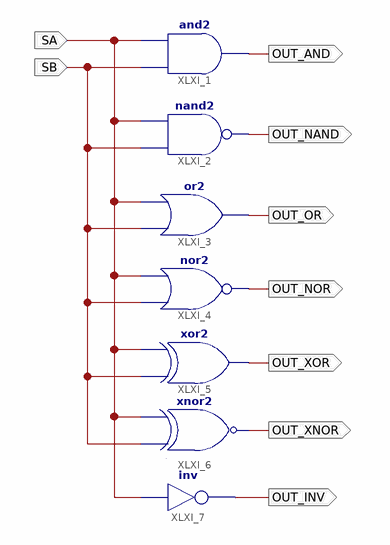
[diagram p0: schematic sheet 1]
// Xilinx ISE schematic GATES.sch (spartan6) as structural Verilog: 7 symbols, 9 ports
module GATES (
  input  SA,
  input  SB,
  output OUT_AND,
  output OUT_INV,
  output OUT_XNOR,
  output OUT_XOR,
  output OUT_NOR,
  output OUT_OR,
  output OUT_NAND
);

  and XLXI_1 (OUT_AND, SB, SA);
  not XLXI_7 (OUT_INV, SA);
  xnor XLXI_6 (OUT_XNOR, SB, SA);
  xor XLXI_5 (OUT_XOR, SB, SA);
  nor XLXI_4 (OUT_NOR, SB, SA);
  or XLXI_3 (OUT_OR, SB, SA);
  nand XLXI_2 (OUT_NAND, SB, SA);
endmodule
